# Altium schematic sheet Sheet.SchDoc
size A
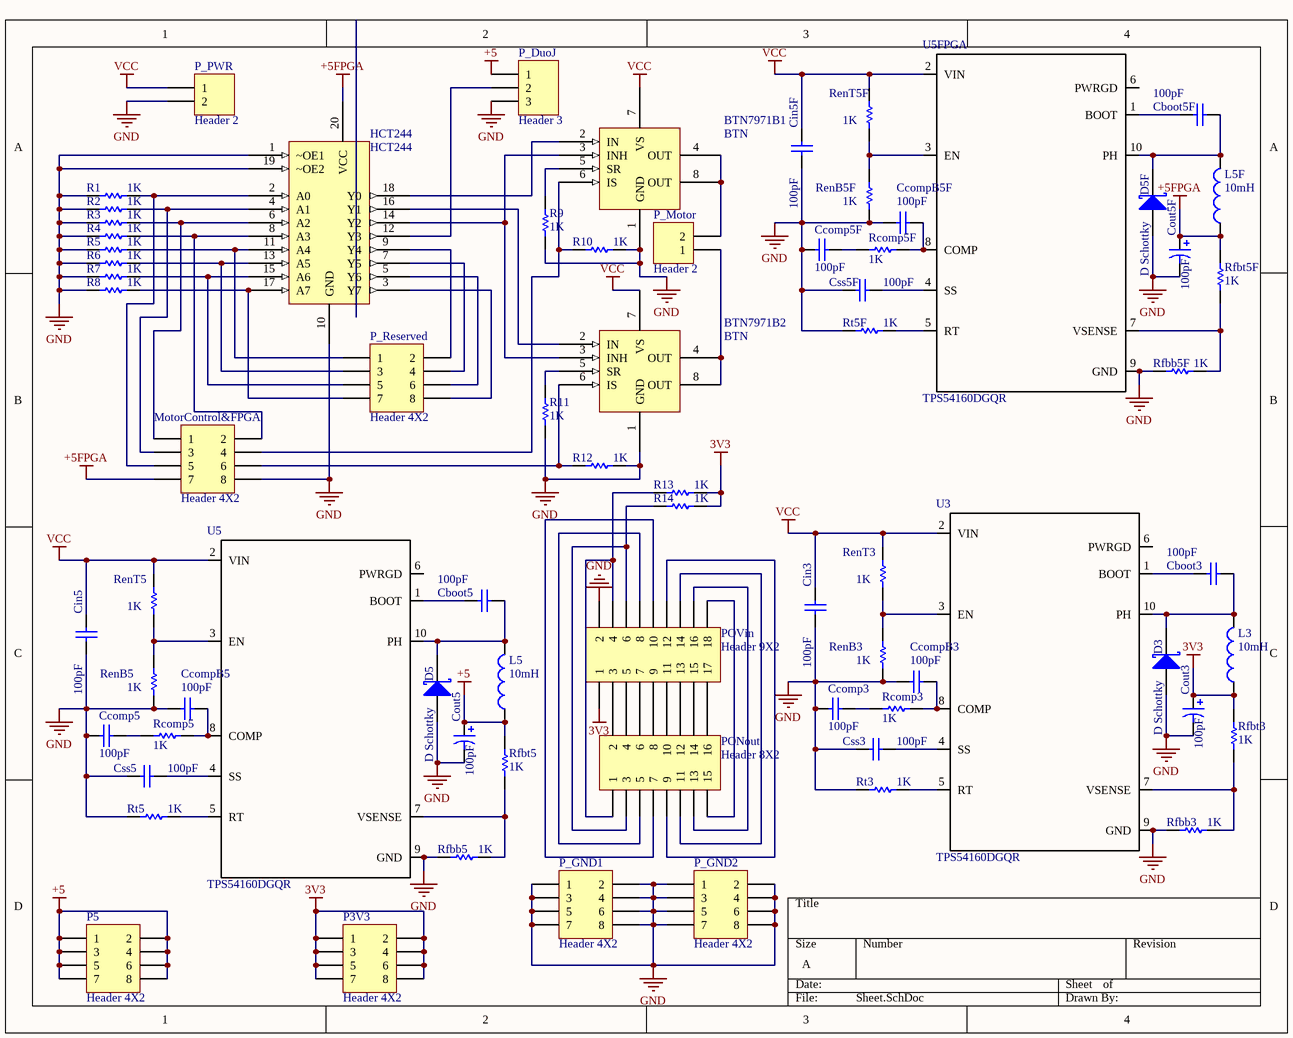
[diagram p0: Sheet.SchDoc]

## Parts
BTN7971B1  BTN  [BTN7971B]
BTN7971B2  BTN  [BTN7971B]
Cboot3  value 100pF  [RAD-0.3]  (hidden comment: Cap)
Cboot5  value 100pF  [RAD-0.3]  (hidden comment: Cap)
Cboot5F  value 100pF  [RAD-0.3]  (hidden comment: Cap)
Ccomp3  value 100pF  [RAD-0.3]  (hidden comment: Cap)
Ccomp5  value 100pF  [RAD-0.3]  (hidden comment: Cap)
Ccomp5F  value 100pF  [RAD-0.3]  (hidden comment: Cap)
CcompB3  value 100pF  [RAD-0.3]  (hidden comment: Cap)
CcompB5  value 100pF  [RAD-0.3]  (hidden comment: Cap)
CcompB5F  value 100pF  [RAD-0.3]  (hidden comment: Cap)
Cin3  value 100pF  [RAD-0.3]  (hidden comment: Cap)
Cin5  value 100pF  [RAD-0.3]  (hidden comment: Cap)
Cin5F  value 100pF  [RAD-0.3]  (hidden comment: Cap)
Cout3  value 100pF  [RB7.6-15]  (hidden comment: Cap Pol1)
Cout5  value 100pF  [RB7.6-15]  (hidden comment: Cap Pol1)
Cout5F  value 100pF  [RB7.6-15]  (hidden comment: Cap Pol1)
Css3  value 100pF  [RAD-0.3]  (hidden comment: Cap)
Css5  value 100pF  [RAD-0.3]  (hidden comment: Cap)
Css5F  value 100pF  [RAD-0.3]  (hidden comment: Cap)
D3  D Schottky  [SMB]
D5  D Schottky  [SMB]
D5F  D Schottky  [SMB]
HCT244  HCT244  [DIP20]
L3  value 10mH  [0805]  (hidden comment: Inductor)
L5  value 10mH  [0805]  (hidden comment: Inductor)
L5F  value 10mH  [0805]  (hidden comment: Inductor)
MotorControl&FPGA  Header 4X2  [HDR2X4]
P3V3  Header 4X2  [HDR2X4]
P5  Header 4X2  [HDR2X4]
P_DuoJ  Header 3  [HDR1X3]
P_GND1  Header 4X2  [HDR2X4]
P_GND2  Header 4X2  [HDR2X4]
P_Motor  Header 2  [HDR1X2]
P_PWR  Header 2  [HDR1X2]
P_Reserved  Header 4X2  [HDR2X4]
PONout  Header 8X2  [HDR2X8]
POVin  Header 9X2  [HDR2X9]
R1  value 1K  [AXIAL-0.3]  (hidden comment: Res1)
R2  value 1K  [AXIAL-0.3]  (hidden comment: Res1)
R3  value 1K  [AXIAL-0.3]  (hidden comment: Res1)
R4  value 1K  [AXIAL-0.3]  (hidden comment: Res1)
R5  value 1K  [AXIAL-0.3]  (hidden comment: Res1)
R6  value 1K  [AXIAL-0.3]  (hidden comment: Res1)
R7  value 1K  [AXIAL-0.3]  (hidden comment: Res1)
R8  value 1K  [AXIAL-0.3]  (hidden comment: Res1)
R9  value 1K  [AXIAL-0.3]  (hidden comment: Res1)
R10  value 1K  [AXIAL-0.3]  (hidden comment: Res1)
R11  value 1K  [AXIAL-0.3]  (hidden comment: Res1)
R12  value 1K  [AXIAL-0.3]  (hidden comment: Res1)
R13  value 1K  [AXIAL-0.3]  (hidden comment: Res1)
R14  value 1K  [AXIAL-0.3]  (hidden comment: Res1)
Rcomp3  value 1K  [AXIAL-0.3]  (hidden comment: Res1)
Rcomp5  value 1K  [AXIAL-0.3]  (hidden comment: Res1)
Rcomp5F  value 1K  [AXIAL-0.3]  (hidden comment: Res1)
RenB3  value 1K  [AXIAL-0.3]  (hidden comment: Res1)
RenB5  value 1K  [AXIAL-0.3]  (hidden comment: Res1)
RenB5F  value 1K  [AXIAL-0.3]  (hidden comment: Res1)
RenT3  value 1K  [AXIAL-0.3]  (hidden comment: Res1)
RenT5  value 1K  [AXIAL-0.3]  (hidden comment: Res1)
RenT5F  value 1K  [AXIAL-0.3]  (hidden comment: Res1)
Rfbb3  value 1K  [AXIAL-0.3]  (hidden comment: Res1)
Rfbb5  value 1K  [AXIAL-0.3]  (hidden comment: Res1)
Rfbb5F  value 1K  [AXIAL-0.3]  (hidden comment: Res1)
Rfbt3  value 1K  [AXIAL-0.3]  (hidden comment: Res1)
Rfbt5  value 1K  [AXIAL-0.3]  (hidden comment: Res1)
Rfbt5F  value 1K  [AXIAL-0.3]  (hidden comment: Res1)
Rt3  value 1K  [AXIAL-0.3]  (hidden comment: Res1)
Rt5  value 1K  [AXIAL-0.3]  (hidden comment: Res1)
Rt5F  value 1K  [AXIAL-0.3]  (hidden comment: Res1)
U3  TPS54160DGQR  [S-PDSO-G10]
U5  TPS54160DGQR  [S-PDSO-G10]
U5FPGA  TPS54160DGQR  [S-PDSO-G10]

## Nets
3V3: Cout3.1 L3.1 P3V3.1 P3V3.2 P3V3.3 P3V3.4 P3V3.5 P3V3.6 P3V3.7 P3V3.8 POVin.1 R13.2 R14.2 Rfbt3.2
+5: Cout5.1 L5.1 P5.1 P5.2 P5.3 P5.4 P5.5 P5.6 P5.7 P5.8 P_DuoJ.1 Rfbt5.2
+5FPGA: Cout5F.1 HCT244.20(VCC) L5F.1 MotorControl&FPGA.7 Rfbt5F.2
GND: BTN7971B1.1(GND) BTN7971B2.1(GND) Ccomp3.2 Ccomp5.2 Ccomp5F.2 CcompB3.1 CcompB5.1 CcompB5F.1 Cin3.1 Cin5.1 Cin5F.1 Cout3.2 Cout5.2 Cout5F.2 Css3.1 Css5.1 Css5F.1 D3.1(A) D5.1(A) D5F.1(A) HCT244.1(~OE1) HCT244.10(GND) HCT244.19(~OE2) MotorControl&FPGA.8 P_DuoJ.3 P_GND1.1 P_GND1.2 P_GND1.3 P_GND1.4 P_GND1.5 P_GND1.6 P_GND1.7 P_GND1.8 P_GND2.1 P_GND2.2 P_GND2.3 P_GND2.4 P_GND2.5 P_GND2.6 P_GND2.7 P_GND2.8 P_PWR.2 POVin.2 R1.1 R2.1 R3.1 R4.1 R5.1 R6.1 R7.1 R8.1 R9.1 R10.2 R11.1 R12.2 RenB3.1 RenB5.1 RenB5F.1 Rfbb3.1 Rfbb5.1 Rfbb5F.1 Rt3.1 Rt5.1 Rt5F.1 U3.9(GND) U3.11(GND) U5.9(GND) U5.11(GND) U5FPGA.9(GND) U5FPGA.11(GND)
VCC: BTN7971B1.7(VS) BTN7971B2.7(VS) Cin3.2 Cin5.2 Cin5F.2 P_PWR.1 RenT3.2 RenT5.2 RenT5F.2 U3.2(VIN) U5.2(VIN) U5FPGA.2(VIN)
NetBTN7971B1_2: BTN7971B1.2(IN) HCT244.18(Y0)
NetBTN7971B1_3: BTN7971B1.3(INH) BTN7971B2.3(INH) HCT244.14(Y2)
NetBTN7971B1_4: BTN7971B1.4(OUT) BTN7971B1.8(OUT) P_Motor.2
NetBTN7971B1_5: BTN7971B1.5(SR) R9.2
NetBTN7971B1_6: BTN7971B1.6(IS) MotorControl&FPGA.4 R10.1
NetBTN7971B2_2: BTN7971B2.2(IN) HCT244.16(Y1)
NetBTN7971B2_4: BTN7971B2.4(OUT) BTN7971B2.8(OUT) P_Motor.1
NetBTN7971B2_5: BTN7971B2.5(SR) R11.2
NetBTN7971B2_6: BTN7971B2.6(IS) MotorControl&FPGA.6 R12.1
NetCboot3_1: Cboot3.1 U3.1(BOOT)
NetCboot3_2: Cboot3.2 D3.2(K) L3.2 U3.10(PH)
NetCboot5_1: Cboot5.1 U5.1(BOOT)
NetCboot5_2: Cboot5.2 D5.2(K) L5.2 U5.10(PH)
NetCboot5F_1: Cboot5F.1 U5FPGA.1(BOOT)
NetCboot5F_2: Cboot5F.2 D5F.2(K) L5F.2 U5FPGA.10(PH)
NetCcomp3_1: Ccomp3.1 Rcomp3.2
NetCcomp5_1: Ccomp5.1 Rcomp5.2
NetCcomp5F_1: Ccomp5F.1 Rcomp5F.2
NetCcompB3_2: CcompB3.2 Rcomp3.1 U3.8(COMP)
NetCcompB5_2: CcompB5.2 Rcomp5.1 U5.8(COMP)
NetCcompB5F_2: CcompB5F.2 Rcomp5F.1 U5FPGA.8(COMP)
NetCss3_2: Css3.2 U3.4(SS)
NetCss5_2: Css5.2 U5.4(SS)
NetCss5F_2: Css5F.2 U5FPGA.4(SS)
NetHCT244_2: HCT244.2(A0) MotorControl&FPGA.5 R1.2
NetHCT244_3: HCT244.3(Y7) P_Reserved.8
NetHCT244_4: HCT244.4(A1) MotorControl&FPGA.3 R2.2
NetHCT244_5: HCT244.5(Y6) P_Reserved.6
NetHCT244_6: HCT244.6(A2) MotorControl&FPGA.1 R3.2
NetHCT244_7: HCT244.7(Y5) P_Reserved.4
NetHCT244_8: HCT244.8(A3) MotorControl&FPGA.2 R4.2
NetHCT244_9: HCT244.9(Y4) P_Reserved.2
NetHCT244_11: HCT244.11(A4) P_Reserved.1 R5.2
NetHCT244_12: HCT244.12(Y3) P_DuoJ.2
NetHCT244_13: HCT244.13(A5) P_Reserved.3 R6.2
NetHCT244_15: HCT244.15(A6) P_Reserved.5 R7.2
NetHCT244_17: HCT244.17(A7) P_Reserved.7 R8.2
NetPONout_1: PONout.1 POVin.4 R13.1
NetPONout_2: PONout.2 POVin.3
NetPONout_3: PONout.3 POVin.6 R14.1
NetPONout_4: PONout.4 POVin.5
NetPONout_5: PONout.5 POVin.8
NetPONout_6: PONout.6 POVin.7
NetPONout_7: PONout.7 POVin.10
NetPONout_8: PONout.8 POVin.9
NetPONout_9: PONout.9 POVin.12
NetPONout_10: PONout.10 POVin.11
NetPONout_11: PONout.11 POVin.14
NetPONout_12: PONout.12 POVin.13
NetPONout_13: PONout.13 POVin.16
NetPONout_14: PONout.14 POVin.15
NetPONout_15: PONout.15 POVin.18
NetPONout_16: PONout.16 POVin.17
NetRenB3_2: RenB3.2 RenT3.1 U3.3(EN)
NetRenB5_2: RenB5.2 RenT5.1 U5.3(EN)
NetRenB5F_2: RenB5F.2 RenT5F.1 U5FPGA.3(EN)
NetRfbb3_2: Rfbb3.2 Rfbt3.1 U3.7(VSENSE)
NetRfbb5_2: Rfbb5.2 Rfbt5.1 U5.7(VSENSE)
NetRfbb5F_2: Rfbb5F.2 Rfbt5F.1 U5FPGA.7(VSENSE)
NetRt3_2: Rt3.2 U3.5(RT)
NetRt5_2: Rt5.2 U5.5(RT)
NetRt5F_2: Rt5F.2 U5FPGA.5(RT)

Not connected (* = marked no-connect by the designer): U3 6(PWRGD); U5 6(PWRGD); U5FPGA 6(PWRGD)

## Library data of the parts
Cboot3 Cboot5 Cboot5F Ccomp3 Ccomp5 Ccomp5F CcompB3 CcompB5 CcompB5F Cin3 Cin5 Cin5F Css3 Css5 Css5F = Cap: Capacitor; Published: 8-Jun-2000; LatestRevisionDate: 17-Jul-2002; LatestRevisionNote: Re-released for DXP Platform.; PackageReference: RAD-0.3; Publisher: Altium Limited; PackageDescription: Radial Cap, Thru-Hole; 2 Leads; 0.3 in Pin Spacing
Cout3 Cout5 Cout5F = Cap Pol1: Polarized Capacitor (Radial); Published: 8-Jun-2000; LatestRevisionDate: 17-Jul-2002; LatestRevisionNote: Re-released for DXP Platform.; PackageReference: RB7.6-15; Publisher: Altium Limited; PackageDescription: Polarized Capacitor (Radial); 2 Leads
D3 D5 D5F = D Schottky: Schottky Diode; Published: 8-Jun-2000; LatestRevisionDate: 17-Jul-2002; LatestRevisionNote: Re-released for DXP Platform.; PackageReference: SMB; Publisher: Altium Limited; PackageDescription: DO-214-AA/SMB; 2 C-Bend Leads; Body 5.3 x 3.6 mm, inc. leads (LxW); Code_JEDEC: DO-214-AA
L3 L5 L5F = Inductor: Code_IEC: 1005; Published: 8-Jun-2000; LatestRevisionDate: 29-May-2009; LatestRevisionNote: IPC-7351 Footprint Added.; PackageReference: 0402-A; Publisher: Altium Limited; PackageDescription: Chip Inductor; Code_JEITA: 0402
MotorControl&FPGA P3V3 P5 P_GND1 P_GND2 P_Reserved = Header 4X2: Header, 4-Pin, Dual row; LatestRevisionDate: 17-Jul-2002; LatestRevisionNote: Re-released for DXP Platform.; Publisher: Altium Limited
P_DuoJ = Header 3: Header, 3-Pin; LatestRevisionDate: 17-Jul-2002; LatestRevisionNote: Re-released for DXP Platform.; Publisher: Altium Limited
P_Motor P_PWR = Header 2: Header, 2-Pin; LatestRevisionDate: 17-Jul-2002; LatestRevisionNote: Re-released for DXP Platform.; Publisher: Altium Limited
PONout = Header 8X2: Header, 8-Pin, Dual row; LatestRevisionDate: 17-Jul-2002; LatestRevisionNote: Re-released for DXP Platform.; Publisher: Altium Limited
POVin = Header 9X2: Header, 9-Pin, Dual row; LatestRevisionDate: 17-Jul-2002; LatestRevisionNote: Re-released for DXP Platform.; Publisher: Altium Limited
R1-R14 Rcomp3 Rcomp5 Rcomp5F RenB3 RenB5 RenB5F RenT3 RenT5 RenT5F Rfbb3 Rfbb5 Rfbb5F Rfbt3 Rfbt5 Rfbt5F Rt3 Rt5 Rt5F = Res1: Resistor; Published: 8-Jun-2000; LatestRevisionDate: 17-Jul-2002; LatestRevisionNote: Re-released for DXP Platform.; PackageReference: AXIAL-0.3; Publisher: Altium Limited; PackageDescription: Axial Device, Thru-Hole; 2 Leads; 0.3 in Pin Spacing
U3 U5 U5FPGA = TPS54160DGQR: Imported; Manufacturer_Part_Number: TPS54140DGQR; Vendor: Texas Instruments; Manufacturer_Name: Texas Instruments; RefDes: RefDes; TYPE: TYPE; Value: Value